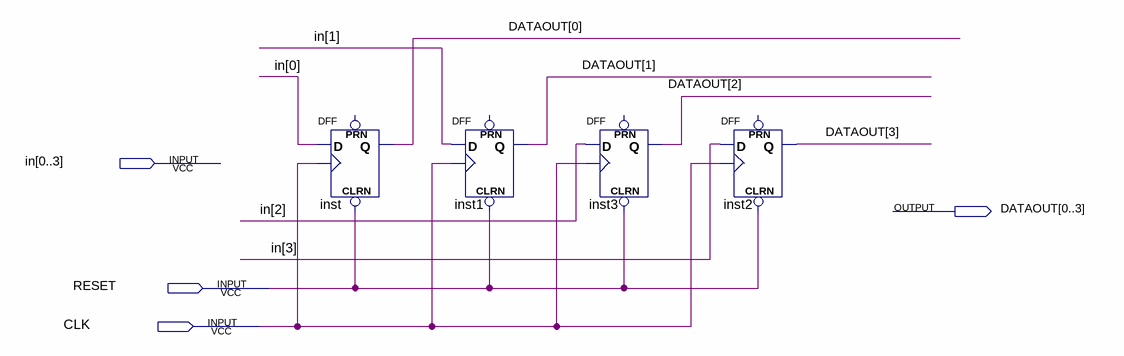
[diagram p0: schematic sheet]
// Quartus schematic Block1.bdf as structural Verilog: 4 symbols, 4 pins
module Block1 (
  input  [0:3] in,
  input  RESET,
  input  CLK,
  output [0:3] DATAOUT
);

  DFF inst (.CLRN(RESET), .CLK(CLK), .D(in[0]), .Q(DATAOUT[0]));  // open: PRN
  DFF inst1 (.CLRN(RESET), .CLK(CLK), .D(in[1]), .Q(DATAOUT[1]));  // open: PRN
  DFF inst3 (.CLRN(RESET), .CLK(CLK), .D(in[2]), .Q(DATAOUT[2]));  // open: PRN
  DFF inst2 (.CLRN(RESET), .CLK(CLK), .D(in[3]), .Q(DATAOUT[3]));  // open: PRN
endmodule
